# EAGLE design ESP32-Hutschiene-2.0 (EAGLE 9.1.0)
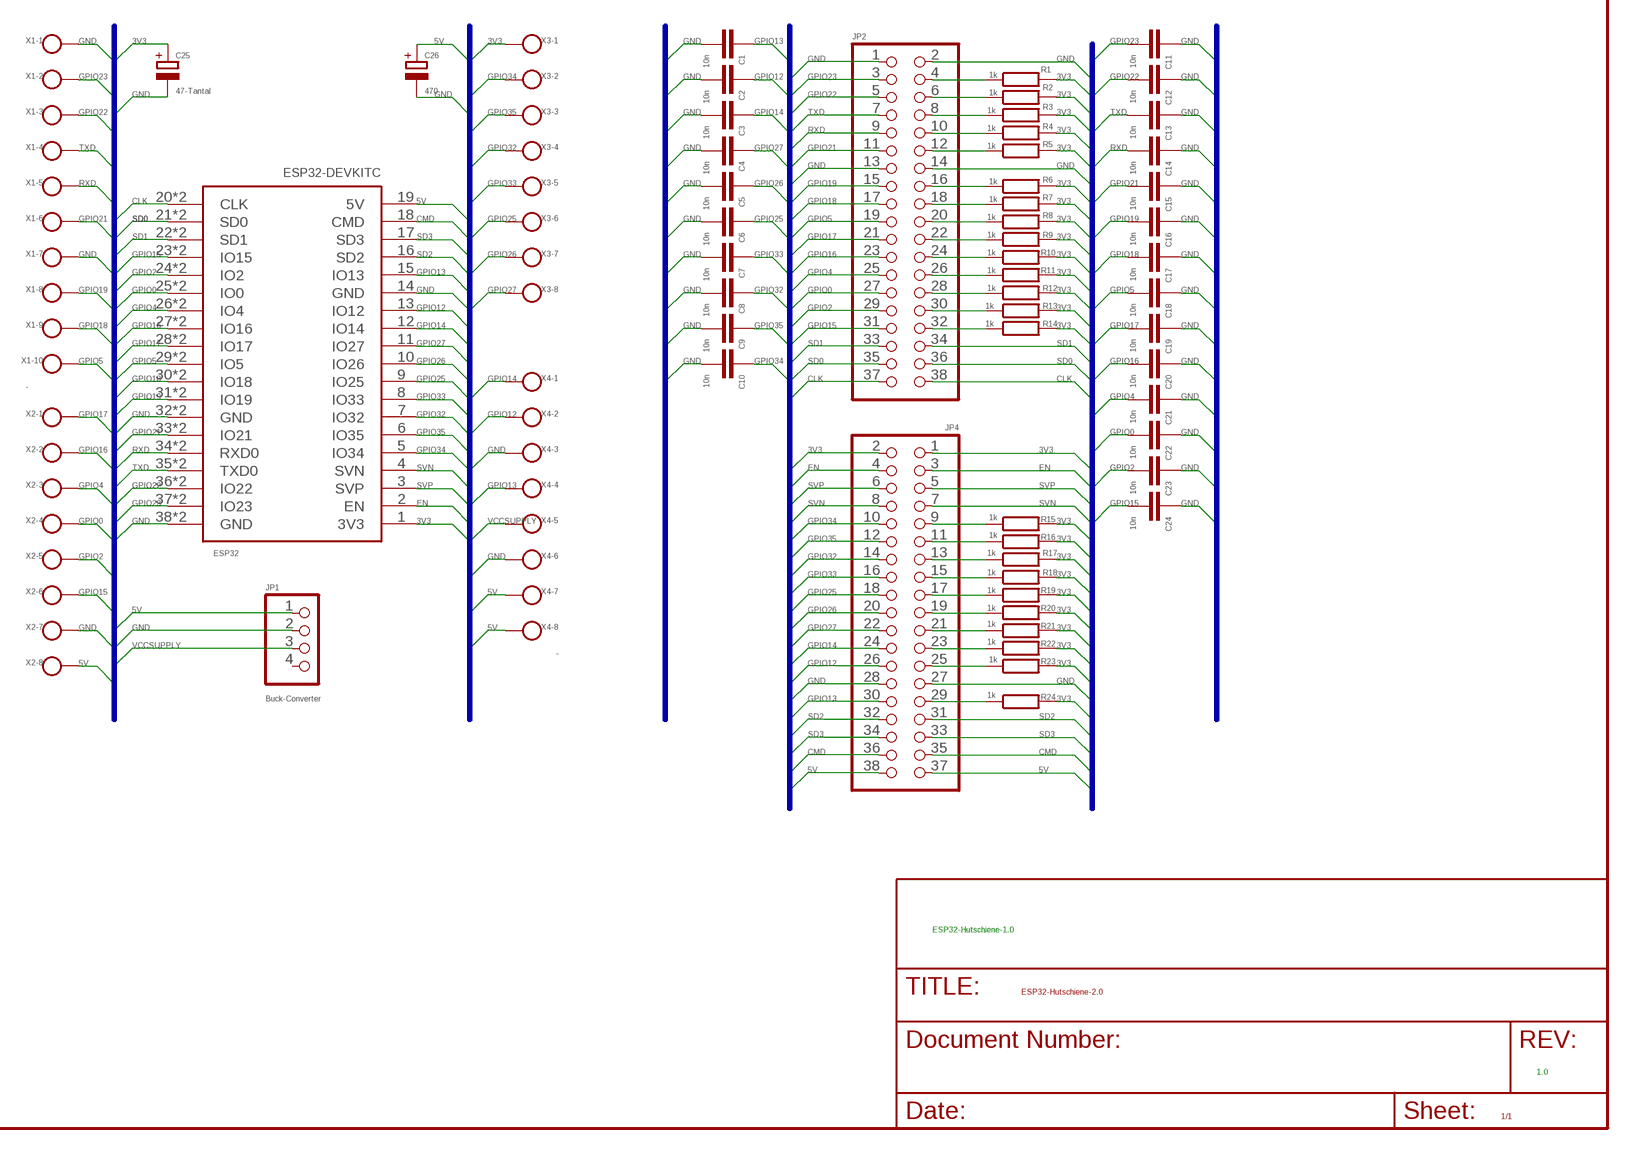
[diagram p0: schematic, sheet 1]

## Parts
C1  10n  C-EUC0603  [C0603]
C2  10n  C-EUC0603  [C0603]
C3  10n  C-EUC0603  [C0603]
C4  10n  C-EUC0603  [C0603]
C5  10n  C-EUC0603  [C0603]
C6  10n  C-EUC0603  [C0603]
C7  10n  C-EUC0603  [C0603]
C8  10n  C-EUC0603  [C0603]
C9  10n  C-EUC0603  [C0603]
C10  10n  C-EUC0603  [C0603]
C11  10n  C-EUC0603  [C0603]
C12  10n  C-EUC0603  [C0603]
C13  10n  C-EUC0603  [C0603]
C14  10n  C-EUC0603  [C0603]
C15  10n  C-EUC0603  [C0603]
C16  10n  C-EUC0603  [C0603]
C17  10n  C-EUC0603  [C0603]
C18  10n  C-EUC0603  [C0603]
C19  10n  C-EUC0603  [C0603]
C20  10n  C-EUC0603  [C0603]
C21  10n  C-EUC0603  [C0603]
C22  10n  C-EUC0603  [C0603]
C23  10n  C-EUC0603  [C0603]
C24  10n  C-EUC0603  [C0603]
C25  47-Tantal  CPOL-EUE3.5-8  [E3,5-8]
C26  470  CPOL-EUE3.5-8  [E3,5-8]
ESP32  ESP32-DEVKITC-38P  [ESP32-DEVKITC-38P]
JP1  Buck-Converter  PINHD-1X4  [1X04]
JP2  PINHD-2X19  [2X19]
JP4  PINHD-2X19  [2X19]
R1  1k  R-EU_R0603  [R0603]
R2  1k  R-EU_R0603  [R0603]
R3  1k  R-EU_R0603  [R0603]
R4  1k  R-EU_R0603  [R0603]
R5  1k  R-EU_R0603  [R0603]
R6  1k  R-EU_R0603  [R0603]
R7  1k  R-EU_R0603  [R0603]
R8  1k  R-EU_R0603  [R0603]
R9  1k  R-EU_R0603  [R0603]
R10  1k  R-EU_R0603  [R0603]
R11  1k  R-EU_R0603  [R0603]
R12  1k  R-EU_R0603  [R0603]
R13  1k  R-EU_R0603  [R0603]
R14  1k  R-EU_R0603  [R0603]
R15  1k  R-EU_R0603  [R0603]
R16  1k  R-EU_R0603  [R0603]
R17  1k  R-EU_R0603  [R0603]
R18  1k  R-EU_R0603  [R0603]
R19  1k  R-EU_R0603  [R0603]
R20  1k  R-EU_R0603  [R0603]
R21  1k  R-EU_R0603  [R0603]
R22  1k  R-EU_R0603  [R0603]
R23  1k  R-EU_R0603  [R0603]
R24  1k  R-EU_R0603  [R0603]
X1  -  W237-10P  [W237-10P]
X2  W237-08P  [W237-8P]
X3  W237-09P  [W237-9P]
X4  -  W237-08P  [W237-8P]

## Nets
3V3 [VCCSUPPLY]: C25.+ ESP32.1(3V3) JP4.1 JP4.2 R1.2 R2.2 R3.2 R4.2 R5.2 R6.2 R7.2 R8.2 R9.2 R10.2 R11.2 R12.2 R13.2 R14.2 R15.2 R16.2 R17.2 R18.2 R19.2 R20.2 R21.2 R22.2 R23.2 R24.2 X3.1
5V [VCCSUPPLY]: C26.+ ESP32.19(5V) JP1.1 JP4.37 JP4.38 X2.8 X4.7 X4.8
CLK [SIGNAL]: ESP32.20(CLK) ESP32.57(CLK) JP2.37 JP2.38
CMD [SIGNAL]: ESP32.18(CMD) JP4.35 JP4.36
EN [SIGNAL]: ESP32.2(EN) JP4.3 JP4.4
GND [VCCSUPPLY]: C1.2 C2.2 C3.2 C4.2 C5.2 C6.2 C7.2 C8.2 C9.2 C10.2 C11.1 C12.1 C13.1 C14.1 C15.1 C16.1 C17.1 C18.1 C19.1 C20.1 C21.1 C22.1 C23.1 C24.1 C25.- C26.- ESP32.14(GND) ESP32.32(GND) ESP32.38(GND) ESP32.39(GND) ESP32.45(GND) JP1.2 JP2.1 JP2.2 JP2.13 JP2.14 JP4.27 JP4.28 X1.1 X1.7 X2.7 X4.3 X4.6
GPIO0 [SIGNAL]: C22.2 ESP32.25(IO0) ESP32.52(IO0) JP2.27 X2.4
GPIO2 [SIGNAL]: C23.2 ESP32.24(IO2) ESP32.53(IO2) JP2.29 X2.5
GPIO4 [SIGNAL]: C21.2 ESP32.26(IO4) ESP32.51(IO4) JP2.25 X2.3
GPIO5 [SIGNAL]: C18.2 ESP32.29(IO5) ESP32.48(IO5) JP2.19 X1.10
GPIO12 [SIGNAL]: C2.1 ESP32.13(IO12) JP4.26 X4.2
GPIO13 [SIGNAL]: C1.1 ESP32.15(IO13) JP4.30 X4.4
GPIO14 [SIGNAL]: C3.1 ESP32.12(IO14) JP4.24 X4.1
GPIO15 [SIGNAL]: C24.2 ESP32.23(IO15) ESP32.54(IO15) JP2.31 X2.6
GPIO16 [SIGNAL]: C20.2 ESP32.27(IO16) ESP32.50(IO16) JP2.23 X2.2
GPIO17 [SIGNAL]: C19.2 ESP32.28(IO17) ESP32.49(IO17) JP2.21 X2.1
GPIO18 [SIGNAL]: C17.2 ESP32.30(IO18) ESP32.47(IO18) JP2.17 X1.9
GPIO19 [SIGNAL]: C16.2 ESP32.31(IO19) ESP32.46(IO19) JP2.15 X1.8
GPIO21 [SIGNAL]: C15.2 ESP32.33(IO21) ESP32.44(IO21) JP2.11 X1.6
GPIO22 [SIGNAL]: C12.2 ESP32.36(IO22) ESP32.41(IO22) JP2.5 X1.3
GPIO23 [SIGNAL]: C11.2 ESP32.37(IO23) ESP32.40(IO23) JP2.3 X1.2
GPIO25 [SIGNAL]: C6.1 ESP32.9(IO25) JP4.18 X3.6
GPIO26 [SIGNAL]: C5.1 ESP32.10(IO26) JP4.20 X3.7
GPIO27 [SIGNAL]: C4.1 ESP32.11(IO27) JP4.22 X3.8
GPIO32 [SIGNAL]: C8.1 ESP32.7(IO32) JP4.14 X3.4
GPIO33 [SIGNAL]: C7.1 ESP32.8(IO33) JP4.16 X3.5
GPIO34 [SIGNAL]: C10.1 ESP32.5(IO34) JP4.10 X3.2
GPIO35 [SIGNAL]: C9.1 ESP32.6(IO35) JP4.12 X3.3
N$1 [SIGNAL]: JP2.4 R1.1
N$2 [SIGNAL]: JP2.6 R2.1
N$3 [SIGNAL]: JP2.8 R3.1
N$4 [SIGNAL]: JP2.10 R4.1
N$5 [SIGNAL]: JP2.12 R5.1
N$6 [SIGNAL]: JP2.16 R6.1
N$7 [SIGNAL]: JP2.18 R7.1
N$8 [SIGNAL]: JP2.20 R8.1
N$9 [SIGNAL]: JP2.22 R9.1
N$10 [SIGNAL]: JP2.24 R10.1
N$11 [SIGNAL]: JP2.26 R11.1
N$12 [SIGNAL]: JP2.28 R12.1
N$13 [SIGNAL]: JP2.30 R13.1
N$14 [SIGNAL]: JP2.32 R14.1
N$15 [SIGNAL]: JP4.9 R15.1
N$16 [SIGNAL]: JP4.11 R16.1
N$17 [SIGNAL]: JP4.13 R17.1
N$18 [SIGNAL]: JP4.15 R18.1
N$19 [SIGNAL]: JP4.17 R19.1
N$20 [SIGNAL]: JP4.19 R20.1
N$21 [SIGNAL]: JP4.21 R21.1
N$22 [SIGNAL]: JP4.23 R22.1
N$23 [SIGNAL]: JP4.25 R23.1
N$24 [SIGNAL]: JP4.29 R24.1
RXD [SIGNAL]: C14.2 ESP32.34(RXD0) ESP32.43(RXD0) JP2.9 X1.5
SD0 [SIGNAL]: ESP32.21(SD0) ESP32.56(SD0) JP2.35 JP2.36
SD1 [SIGNAL]: ESP32.22(SD1) ESP32.55(SD1) JP2.33 JP2.34
SD2 [SIGNAL]: ESP32.16(SD2) JP4.31 JP4.32
SD3 [SIGNAL]: ESP32.17(SD3) JP4.33 JP4.34
SVN [SIGNAL]: ESP32.4(SVN) JP4.7 JP4.8
SVP [SIGNAL]: ESP32.3(SVP) JP4.5 JP4.6
TXD [SIGNAL]: C13.2 ESP32.35(TXD0) ESP32.42(TXD0) JP2.7 X1.4
VCCSUPPLY [VCCSUPPLY]: JP1.3 X4.5
Unconnected: JP1.4 X3.9

## Buses
3V3,5V,CLK,CMD,EN,GND,GPIO0,GPIO2,GPIO[4..5],GPIO[12..19],GPIO[21..23],GPIO[25..27],GPIO[32..35],RXD,SD[0..3],SVN,SVP,TXD,VCCSUPPLY

## Notes on the sheet
- ESP32-Hutschiene-1.0
- 1.0

## Library data of the parts
C1-C24 = rcl:C-EU: CAPACITOR, European symbol; SPICEPREFIX: C
C25 C26 = rcl:CPOL-EU: POLARIZED CAPACITOR, European symbol; SPICEPREFIX: C
ESP32 = ESP32-DEVKITC-38P:ESP32-DEVKITC-38P
JP1 = pinhead:PINHD-1X4: PIN HEADER
JP2 JP4 = pinhead:PINHD-2X19: PIN HEADER
R1-R24 = rcl:R-EU_: RESISTOR, European symbol; SPICEPREFIX: R
X1 = con-wago-508:W237-10P: WAGO SREW CLAMP
X2 X4 = con-wago-508:W237-08P: WAGO SREW CLAMP
X3 = con-wago-508:W237-09P: WAGO SREW CLAMP

## Net classes
1 SIGNAL: width 0.152 mm
2 VCCSUPPLY: width 0.508 mm, clearance 0.254 mm

## Board
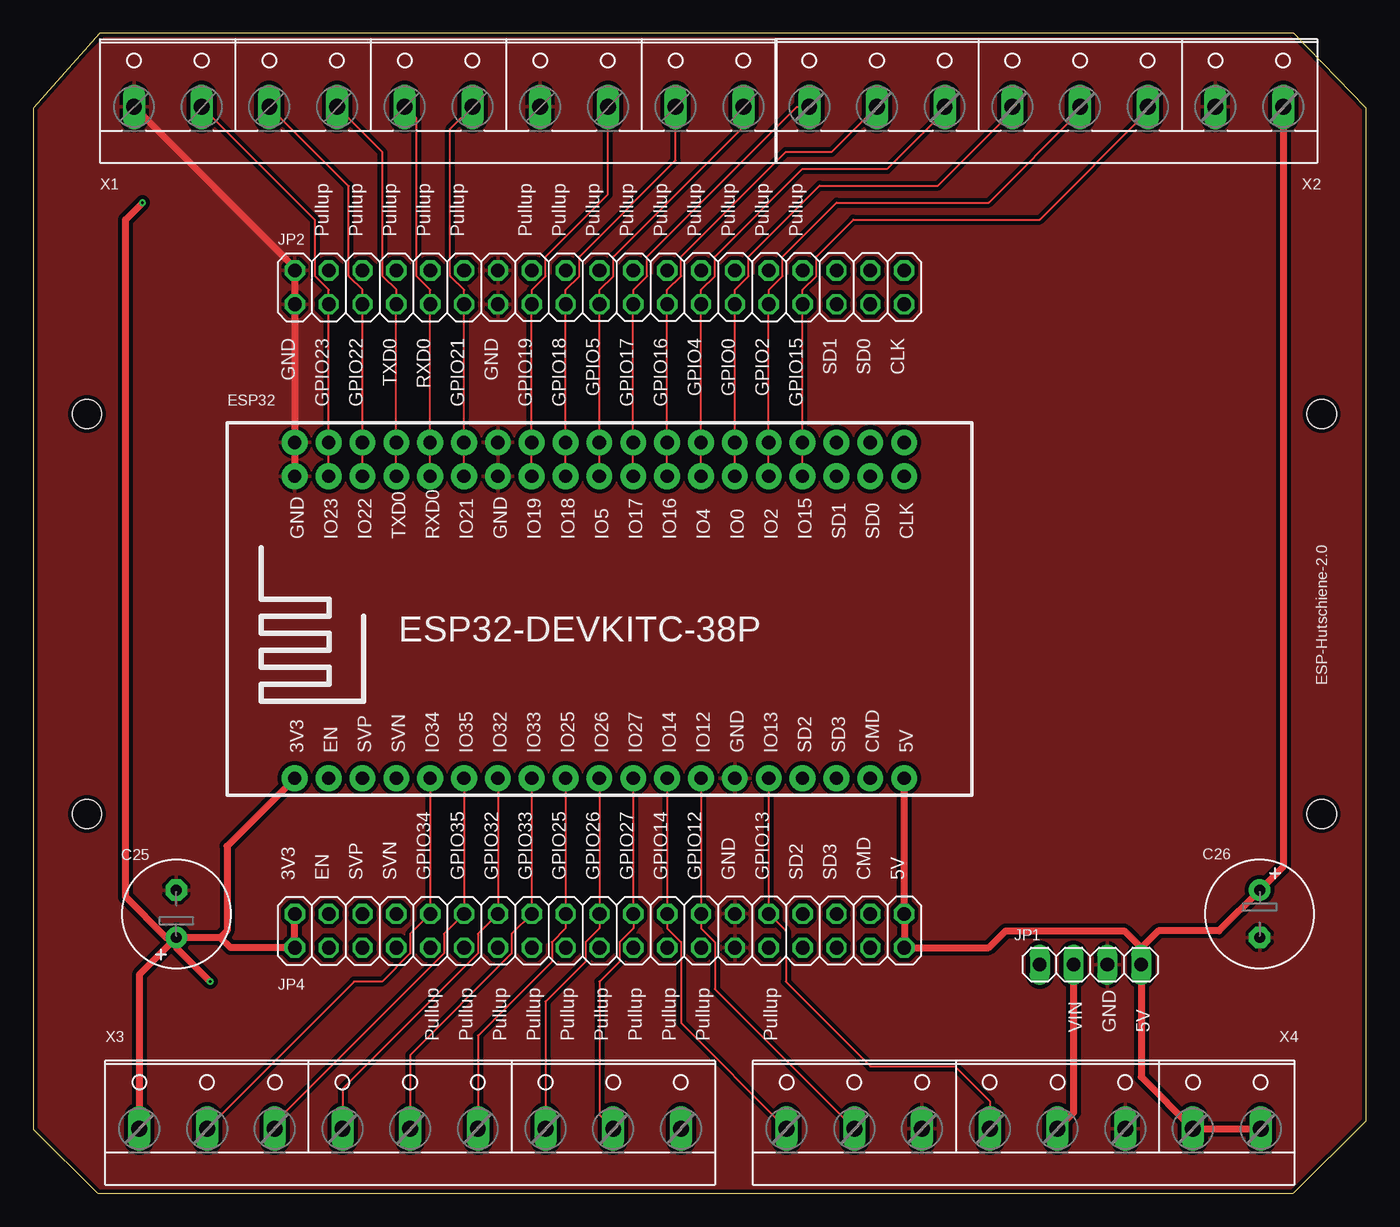
[diagram p1: board, top side]
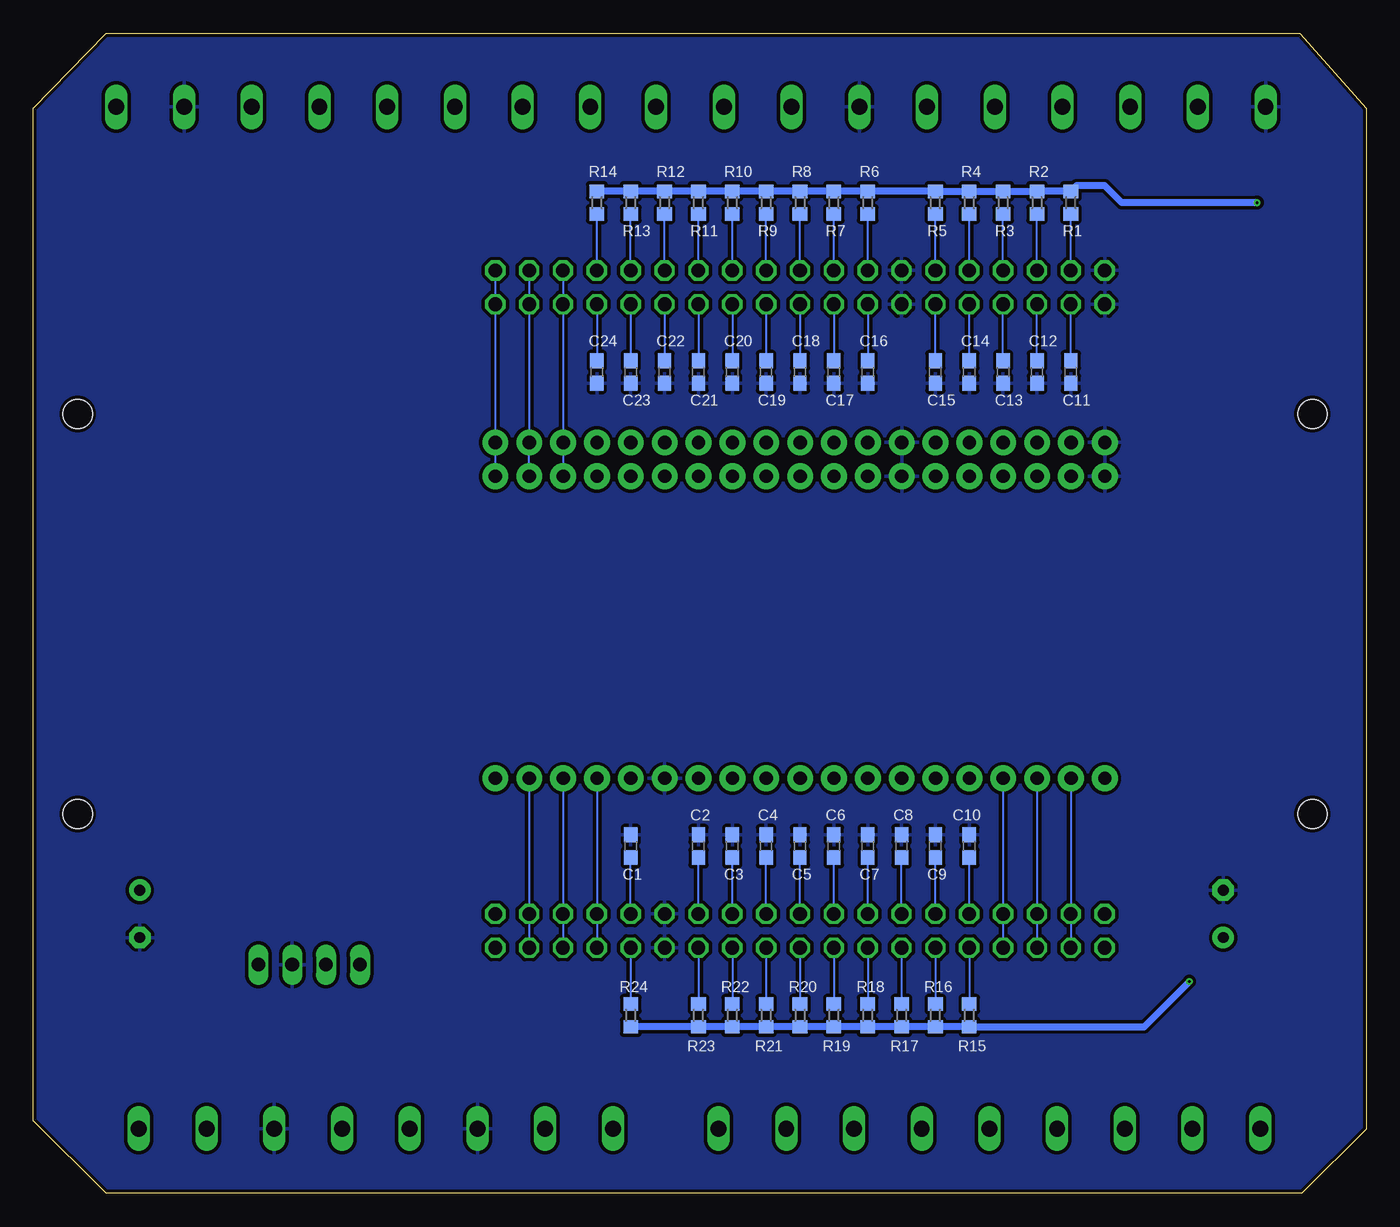
[diagram p2: board, bottom side, seen from below]

Size 100 x 87 mm. Coordinates in mm from the lower left corner, seen from the top.
Outline: 100,5.46 100,81.38 94.55,87 4.99,87 0,81.38 0,4.82 4.82,0 94.55,0 100,5.46
Copper layers (1*16): Top 0.035mm / dielectric 1.5mm / Bottom 0.035mm
Design rules "aisler_2_layer *": minimum track width 0.15mm, minimum drill 0.2mm, track to track 0.2mm, track to pad 0.2mm, pad to pad 0.2mm, via to via 0.1mm, smd to smd 0.1mm, copper to edge 0.2mm, drill to drill 0.21mm, minimum pad ring 0.25mm, minimum via ring 0.15mm, stop-mask expansion 0mil, vias tented up to drill 0mil, thermal gap 10mil
Holes 2.2 mm at 4.03,58.45 4.03,28.45 96.67,28.45 96.67,58.45

### Footprints (pad centres in the part's own frame; a part is rotated, then mirrored left to right if it is on the bottom)
C0603 = smd 1.1 x 1: 1 -0.85,0; 2 0.85,0
E3,5-8 = drill 0.813 pad 1.6: + -1.778,0 | drill 0.813 pad 1.6 octagon: - 1.778,0
ESP32-DEVKITC-38P = drill 1 pad 1.93: 1 -22.87,-11.42; 2 -20.33,-11.42; 3 -17.79,-11.42; 4 -15.25,-11.42; 5 -12.71,-11.42; 6 -10.17,-11.42; 7 -7.63,-11.42; 8 -5.09,-11.42; 9 -2.55,-11.42; 10 -0.01,-11.42; 11 2.53,-11.42; 12 5.07,-11.42; 13 7.61,-11.42; 14 10.15,-11.42; 15 12.69,-11.42; 16 15.23,-11.42; 17 17.77,-11.42; 18 20.31,-11.42; 19 22.85,-11.42; 20 22.85,11.23; 21 20.31,11.23; 22 17.77,11.23; 23 15.23,11.23; 24 12.69,11.23; 25 10.15,11.23; 26 7.61,11.23; 27 5.07,11.23; 28 2.53,11.23; 29 -0.01,11.23; 30 -2.55,11.23; 31 -5.09,11.23; 32 -7.63,11.23; 33 -10.17,11.23; 34 -12.71,11.23; 35 -15.25,11.23; 36 -17.79,11.23; 37 -20.33,11.23; 38 -22.87,11.23; 39 -22.87,13.77; 40 -20.33,13.77; 41 -17.79,13.77; 42 -15.25,13.77; 43 -12.71,13.77; 44 -10.17,13.77; 45 -7.63,13.77; 46 -5.09,13.77; 47 -2.55,13.77; 48 -0.01,13.77; 49 2.53,13.77; 50 5.07,13.77; 51 7.61,13.77; 52 10.15,13.77; 53 12.69,13.77; 54 15.23,13.77; 55 17.77,13.77; 56 20.31,13.77; 57 22.85,13.77
1X04 = drill 1.016 long: 1 -3.81,0; 2 -1.27,0; 3 1.27,0; 4 3.81,0
2X19 = drill 1.016 octagon: 1 -22.86,-1.27; 2 -22.86,1.27; 3 -20.32,-1.27; 4 -20.32,1.27; 5 -17.78,-1.27; 6 -17.78,1.27; 7 -15.24,-1.27; 8 -15.24,1.27; 9 -12.7,-1.27; 10 -12.7,1.27; 11 -10.16,-1.27; 12 -10.16,1.27; 13 -7.62,-1.27; 14 -7.62,1.27; 15 -5.08,-1.27; 16 -5.08,1.27; 17 -2.54,-1.27; 18 -2.54,1.27; 19 0,-1.27; 20 0,1.27; 21 2.54,-1.27; 22 2.54,1.27; 23 5.08,-1.27; 24 5.08,1.27; 25 7.62,-1.27; 26 7.62,1.27; 27 10.16,-1.27; 28 10.16,1.27; 29 12.7,-1.27; 30 12.7,1.27; 31 15.24,-1.27; 32 15.24,1.27; 33 17.78,-1.27; 34 17.78,1.27; 35 20.32,-1.27; 36 20.32,1.27; 37 22.86,-1.27; 38 22.86,1.27
R0603 = smd 1 x 1.1: 1 -0.85,0; 2 0.85,0
W237-10P = drill 1.194 long: 1 -22.86,-0.635; 2 -17.78,-0.635; 3 -12.7,-0.635; 4 -7.62,-0.635; 5 -2.54,-0.635; 6 2.54,-0.635; 7 7.62,-0.635; 8 12.7,-0.635; 9 17.78,-0.635; 10 22.86,-0.635
W237-8P = drill 1.194 long: 1 -17.78,-0.635; 2 -12.7,-0.635; 3 -7.62,-0.635; 4 -2.54,-0.635; 5 2.54,-0.635; 6 7.62,-0.635; 7 12.7,-0.635; 8 17.78,-0.635
W237-9P = drill 1.194 long: 1 -20.32,-0.635; 2 -15.24,-0.635; 3 -10.16,-0.635; 4 -5.08,-0.635; 5 0,-0.635; 6 5.08,-0.635; 7 10.16,-0.635; 8 15.24,-0.635; 9 20.32,-0.635

### Placement (x,y rotation side)
C1  55.18,26.04 90 bottom
C2  50.1,26.04 90 bottom
C3  47.56,26.04 90 bottom
C4  45.02,26.04 90 bottom
C5  42.48,26.04 90 bottom
C6  39.94,26.04 90 bottom
C7  37.4,26.04 90 bottom
C8  34.86,26.04 90 bottom
C9  32.32,26.04 90 bottom
C10  29.78,26.04 90 bottom
C11  22.16,61.59 90 bottom
C12  24.7,61.59 90 bottom
C13  27.24,61.59 90 bottom
C14  29.78,61.59 90 bottom
C15  32.32,61.59 90 bottom
C16  37.4,61.59 90 bottom
C17  39.94,61.59 90 bottom
C18  42.48,61.59 90 bottom
C19  45.02,61.59 90 bottom
C20  47.56,61.59 90 bottom
C21  50.1,61.59 90 bottom
C22  52.64,61.59 90 bottom
C23  55.18,61.59 90 bottom
C24  57.72,61.59 90 bottom
C25  10.73,20.96 90 top
C26  92.01,20.96 270 top
ESP32  42.48,42.55 0 top
JP1  79.31,17.14 180 top
JP2  42.48,67.94 0 top
JP4  42.48,19.69 0 top
R1  22.16,74.29 90 bottom
R2  24.7,74.29 90 bottom
R3  27.24,74.29 90 bottom
R4  29.78,74.29 90 bottom
R5  32.32,74.29 90 bottom
R6  37.4,74.29 90 bottom
R7  39.94,74.29 90 bottom
R8  42.48,74.29 90 bottom
R9  45.02,74.29 90 bottom
R10  47.56,74.29 90 bottom
R11  50.1,74.29 90 bottom
R12  52.64,74.29 90 bottom
R13  55.18,74.29 90 bottom
R14  57.72,74.29 90 bottom
R15  29.78,13.34 270 bottom
R16  32.32,13.34 270 bottom
R17  34.86,13.34 270 bottom
R18  37.4,13.34 270 bottom
R19  39.94,13.34 270 bottom
R20  42.48,13.34 270 bottom
R21  45.02,13.34 270 bottom
R22  47.56,13.34 270 bottom
R23  50.1,13.34 270 bottom
R24  55.18,13.34 270 bottom
X1  30.41,82.12 0 top
X2  76,82.12 0 top
X3  28.27,5.48 0 top
X4  74.3,5.48 0 top

### Tracks (layer width: path | path; a pad name or v marks a point on that pad's centre or on a via)
3V3  (via drill 0.2)
  Top 0.508: 14.03,19.18 14.54,19.69 14.54,26.04 19.61,31.11 ESP32.1 | 14.03,19.18 C25.+ | C25.+ 7.95,16.4 X3.1 | C25.+ 9.97,19.18 6.92,22.23 6.92,73.03 v8.19,74.29 | v13.27,15.88 10.73,18.41 C25.+ | 14.03,19.18 14.79,18.41 JP4.1 JP4.2
  Bottom 0.508: v8.19,74.29 18.35,74.29 19.62,75.56 21.74,75.56 R1.2 R2.2 R3.2 R4.2 R5.2 R6.2 R7.2 R8.2 R9.2 R10.2 R11.2 R12.2 R13.2 R14.2 | v13.27,15.88 16.66,12.48 R15.2 R16.2 R17.2 R18.2 R19.2 R20.2 R21.2 R22.2 R23.2 R24.2
5V
  Top 0.508: X4.8 X4.7 83.12,8.73 JP1.1 83.12,18.41 | 83.12,18.41 81.85,19.69 72.96,19.69 71.69,18.41 JP4.37 JP4.38 ESP32.19 | X2.8 93.78,24.5 C26.+ 88.96,19.69 84.39,19.69 83.12,18.41
CLK
  Bottom 0.152: ESP32.20 ESP32.57 JP2.37 JP2.38
CMD
  Bottom 0.152: ESP32.18 JP4.36 JP4.35
EN
  Bottom 0.152: ESP32.2 JP4.4 JP4.3
GND
  Top 0.508: X1.1 19.62,69.41 JP2.2 JP2.1 ESP32.39 ESP32.38
  pour Bottom (isolate 0.254): 4.38,87 -0.7,81.91 -0.7,4.45 4.38,-0.63 95.82,-0.63 100.9,4.45 100.9,81.91 95.82,87
  pour Top (isolate 0.305): 5.65,87 -0.06,81.28 -0.06,5.08 5.02,0 94.55,0 100.27,5.71 100.27,81.28 94.55,87
GPIO0
  Top 0.152: ESP32.25 ESP32.52 JP2.27 52.64,67.75 53.67,68.79 53.67,70.25 58.99,75.56 67.88,75.56 73.45,81.14 X2.4
  Bottom 0.152: JP2.27 C22.2
GPIO2
  Top 0.152: ESP32.24 ESP32.53 JP2.29 55.18,67.75 56.21,68.79 56.21,70.25 60.26,74.29 71.69,74.29 78.53,81.14 X2.5
  Bottom 0.152: JP2.29 C23.2
GPIO4
  Top 0.152: ESP32.26 ESP32.51 JP2.25 50.1,67.75 51.13,68.79 51.13,70.25 57.72,76.84 64.07,76.84 68.38,81.14 X2.3
  Bottom 0.152: JP2.25 C21.2
GPIO5
  Top 0.152: X1.10 53.27,80 43.51,70.25 43.51,68.79 42.48,67.75 JP2.19 ESP32.48 ESP32.29
  Bottom 0.152: JP2.19 C18.2
GPIO12
  Top 0.152: X4.2 51.13,15.31 51.13,18.84 50.1,19.88 JP4.26 ESP32.13
  Bottom 0.152: JP4.26 C2.1
GPIO13
  Top 0.152: ESP32.15 JP4.30 56.45,19.69 56.45,15.88 62.8,9.53 69.15,9.53 71.76,6.92 X4.4
  Bottom 0.152: JP4.30 C1.1
GPIO14
  Top 0.152: X4.1 48.59,12.77 48.59,18.84 47.56,19.88 JP4.24 ESP32.12
  Bottom 0.152: JP4.24 C3.1
GPIO15
  Top 0.152: ESP32.23 ESP32.54 JP2.31 57.72,67.75 58.75,68.79 58.75,70.25 61.53,73.03 75.5,73.03 83.61,81.14 X2.6
  Bottom 0.152: JP2.31 C24.2
GPIO16
  Top 0.152: ESP32.27 ESP32.50 JP2.23 47.56,67.75 48.59,68.79 48.59,70.25 56.45,78.1 59.91,78.1 X2.2
  Bottom 0.152: JP2.23 C20.2
GPIO17
  Top 0.152: X2.1 57.29,81.49 46.05,70.25 46.05,68.79 45.02,67.75 JP2.21 ESP32.49 ESP32.28
  Bottom 0.152: JP2.21 C19.2
GPIO18
  Top 0.152: X1.9 48.19,77.47 40.97,70.25 40.97,68.79 39.94,67.75 JP2.17 ESP32.47 ESP32.30
  Bottom 0.152: JP2.17 C17.2
GPIO19
  Top 0.152: X1.8 43.11,74.93 38.43,70.25 38.43,68.79 37.4,67.75 JP2.15 ESP32.46 ESP32.31
  Bottom 0.152: JP2.15 C16.2
GPIO21
  Top 0.152: X1.6 31.29,79.82 31.29,68.79 32.32,67.75 JP2.11 ESP32.44 ESP32.33
  Bottom 0.152: C15.2 JP2.11
GPIO22
  Top 0.152: X1.3 23.67,75.53 23.67,68.79 24.7,67.75 JP2.5 ESP32.41 ESP32.36
  Bottom 0.152: C12.2 JP2.5
GPIO23
  Top 0.152: X1.2 21.13,72.99 21.13,68.79 22.16,67.75 JP2.3 ESP32.40 ESP32.37
  Bottom 0.152: C11.2 JP2.3
GPIO25
  Top 0.152: X3.6 33.35,11.82 38.91,17.38 38.91,18.84 39.94,19.88 JP4.18 ESP32.9
  Bottom 0.152: JP4.18 C6.1
GPIO26
  Top 0.152: X3.7 38.43,14.37 41.45,17.38 41.45,18.84 42.48,19.88 JP4.20 ESP32.10
  Bottom 0.152: JP4.20 C5.1
GPIO27
  Top 0.152: X3.8 42.48,5.88 42.48,15.88 43.99,17.38 43.99,18.84 45.02,19.88 JP4.22 ESP32.11
  Bottom 0.152: JP4.22 C4.1
GPIO32
  Top 0.152: X3.4 23.19,7.82 33.35,17.99 33.35,19.45 JP4.14 ESP32.7
  Bottom 0.152: JP4.14 C8.1
GPIO33
  Top 0.152: X3.5 28.27,10.36 35.89,17.99 35.89,19.45 JP4.16 ESP32.8
  Bottom 0.152: JP4.16 C7.1
GPIO34
  Top 0.152: X3.2 24.06,15.88 26.16,15.88 28.27,17.99 28.27,19.45 JP4.10 ESP32.5
  Bottom 0.152: JP4.10 C10.1
GPIO35
  Top 0.152: X3.3 18.11,5.28 30.81,17.99 30.81,19.45 JP4.12 ESP32.6
  Bottom 0.152: JP4.12 C9.1
N$1
  Bottom 0.152: JP2.4 R1.1
N$2
  Bottom 0.152: JP2.6 R2.1
N$3
  Bottom 0.152: JP2.8 R3.1
N$4
  Bottom 0.152: JP2.10 R4.1
N$5
  Bottom 0.152: JP2.12 R5.1
N$6
  Bottom 0.152: JP2.16 R6.1
N$7
  Bottom 0.152: JP2.18 R7.1
N$8
  Bottom 0.152: JP2.20 R8.1
N$9
  Bottom 0.152: JP2.22 R9.1
N$10
  Bottom 0.152: JP2.24 R10.1
N$11
  Bottom 0.152: JP2.26 R11.1
N$12
  Bottom 0.152: JP2.28 R12.1
N$13
  Bottom 0.152: JP2.30 R13.1
N$14
  Bottom 0.152: JP2.32 R14.1
N$15
  Bottom 0.152: JP4.9 R15.1
N$16
  Bottom 0.152: JP4.11 R16.1
N$17
  Bottom 0.152: JP4.13 R17.1
N$18
  Bottom 0.152: JP4.15 R18.1
N$19
  Bottom 0.152: JP4.17 R19.1
N$20
  Bottom 0.152: JP4.19 R20.1
N$21
  Bottom 0.152: JP4.21 R21.1
N$22
  Bottom 0.152: JP4.23 R22.1
N$23
  Bottom 0.152: JP4.25 R23.1
N$24
  Bottom 0.152: JP4.29 R24.1
RXD
  Top 0.152: X1.5 28.75,80.61 28.75,68.79 29.78,67.75 JP2.9 ESP32.43 ESP32.34
  Bottom 0.152: C14.2 JP2.9
SD0
  Bottom 0.152: JP2.36 JP2.35 ESP32.56 ESP32.21
SD1
  Bottom 0.152: JP2.34 JP2.33 ESP32.55 ESP32.22
SD2
  Bottom 0.152: ESP32.16 JP4.32 JP4.31
SD3
  Bottom 0.152: ESP32.17 JP4.34 JP4.33
SVN
  Bottom 0.152: ESP32.4 JP4.8 JP4.7
SVP
  Bottom 0.152: ESP32.3 JP4.6 JP4.5
TXD
  Top 0.152: X1.4 26.21,78.07 26.21,68.79 27.24,67.75 JP2.7 ESP32.42 ESP32.35
  Bottom 0.152: C13.2 JP2.7
VCCSUPPLY
  Top 0.508: JP1.3 78.04,6.04 X4.5

### Text on the board
tNames: Pullup | Pullup | Pullup | Pullup | Pullup | Pullup | Pullup | Pullup | Pullup | Pullup | Pullup | Pullup | Pullup | Pullup | GND | GPIO23 | GPIO22 | TXD0 | RXD0 | GPIO21 | GND | GPIO19 | GPIO18 | GPIO5 | GPIO17 | GPIO16 | GPIO4 | GPIO0 | GPIO2 | GPIO15 | SD1 | SD0 | CLK | ESP-Hutschiene-2.0 | 3V3 | EN | SVP | SVN | GPIO34 | GPIO35 | GPIO32 | GPIO33 | GPIO25 | GPIO26 | GPIO27 | GPIO14 | GPIO12 | GND | GPIO13 | SD2 | SD3 | CMD | 5V | VIN | GND | 5V | Pullup | Pullup | Pullup | Pullup | Pullup | Pullup | Pullup | Pullup | Pullup | Pullup